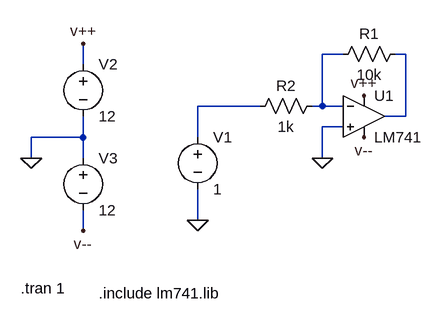
[diagram p0: schematic Simu opamp LM741.asc]
Simu opamp LM741.asc, the LTspice schematic file:
Version 4
SHEET 1 1320 680
WIRE 16 32 -16 32
WIRE 112 32 96 32
WIRE -384 48 -384 16
WIRE -112 112 -208 112
WIRE -16 112 -16 32
WIRE -16 112 -32 112
WIRE 16 112 -16 112
WIRE 112 128 112 32
WIRE 112 128 80 128
WIRE 16 144 -16 144
WIRE -384 160 -384 128
WIRE -384 160 -464 160
WIRE -208 160 -208 112
WIRE -464 192 -464 160
WIRE -384 192 -384 160
WIRE -16 192 -16 144
WIRE -208 288 -208 240
WIRE -384 304 -384 272
FLAG -464 192 0
FLAG -208 288 0
FLAG -16 192 0
FLAG -384 16 v++
FLAG -384 304 v--
FLAG 48 96 v++
FLAG 48 160 v--
SYMBOL OpAmps\\opamp2 48 64 R0
SYMATTR InstName U1
SYMATTR Value LM741
SYMBOL voltage -208 144 R0
WINDOW 123 0 0 Left 0
WINDOW 39 0 0 Left 0
SYMATTR InstName V1
SYMATTR Value 1
SYMBOL res 112 16 R90
WINDOW 0 0 56 VBottom 2
WINDOW 3 32 56 VTop 2
SYMATTR InstName R1
SYMATTR Value 10k
SYMBOL res -16 96 R90
WINDOW 0 0 56 VBottom 2
WINDOW 3 32 56 VTop 2
SYMATTR InstName R2
SYMATTR Value 1k
SYMBOL voltage -384 32 R0
WINDOW 123 0 0 Left 0
WINDOW 39 0 0 Left 0
SYMATTR InstName V2
SYMATTR Value 12
SYMBOL voltage -384 176 R0
WINDOW 123 0 0 Left 0
WINDOW 39 0 0 Left 0
SYMATTR InstName V3
SYMATTR Value 12
TEXT -360 400 Left 2 !.include lm741.lib
TEXT -480 392 Left 2 !.tran 1

The netlist it stands for:
* Simu opamp LM741.asc
XU1 0 N001 v++ v-- N002 LM741  ; pins In+ In- V+ V- OUT
V1 N003 0 1
R1 N002 N001 10k
R2 N001 N003 1k
V2 v++ 0 12
V3 0 v-- 12
.include lm741.lib
.tran 1
.backanno
.end